# Altium project LSS_Gripper_Top_Board.PrjPcb
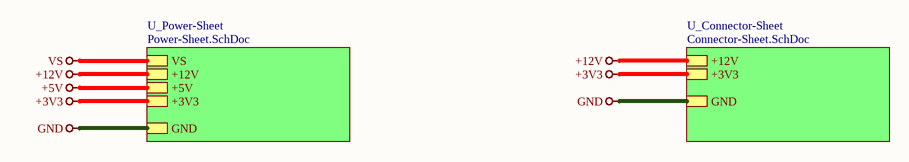
[diagram p0: Top-Sheet.SchDoc]
3 sheets, 36 parts. Net scope: hierarchical (ports join the sheet entries above them; power ports are global).
Board files: PCB1.PcbDoc, GripperTopBoard.PcbDoc
Sheets:
  Top-Sheet.SchDoc
    U_Connector-Sheet = Connector-Sheet.SchDoc
    U_Power-Sheet = Power-Sheet.SchDoc

## Sheet Top-Sheet.SchDoc
size 420 x 297 mm; SheetNumber: 1; SheetTotal: 3

### Sub-sheets
U_Connector-Sheet = Connector-Sheet.SchDoc: +12V, +3V3, GND
U_Power-Sheet = Power-Sheet.SchDoc: +12V, +5V, +3V3, GND, VS

### Nets
+3V3: sheet U_Connector-Sheet/+3V3, sheet U_Power-Sheet/+3V3
+12V: sheet U_Connector-Sheet/+12V, sheet U_Power-Sheet/+12V
GND: sheet U_Connector-Sheet/GND, sheet U_Power-Sheet/GND

### Notes on the sheet
- File:
- Title:
- Date:
- Page
- Num:
- Total:
- Drawn By: Huzaifa Ali

## Sheet Connector-Sheet.SchDoc
size 420 x 297 mm; SheetNumber: 3; SheetTotal: 3
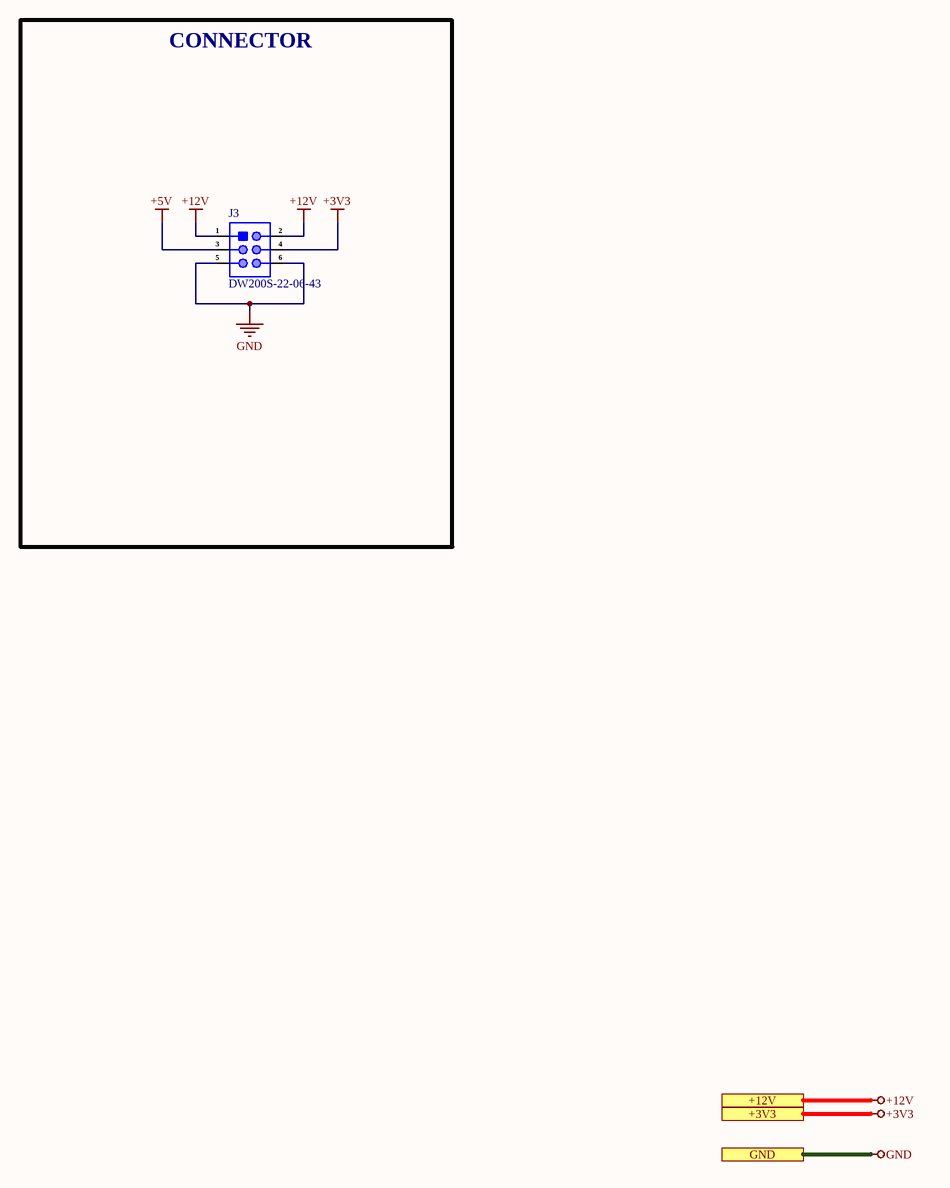
[diagram p1: Connector-Sheet.SchDoc]

### Parts
J3  DW200S-22-06-43  [HDR2X3 (Female SMD)]

### Blocks framed on the sheet
CONNECTOR: J3

### Ports
+3V3 (see Top-Sheet[3A], Power-Sheet[4D]), +12V (see Top-Sheet[3A], Power-Sheet[4D]), GND (see Top-Sheet[3B], Power-Sheet[4D])

### Nets
+3V3: J3.4 ; port +3V3
+5V: J3.3
+12V: J3.1 J3.2 ; port +12V
GND: J3.5 J3.6 ; port GND

### Notes on the sheet
- File:
- Title:
- Date:
- Page
- Num:
- Total:
- Drawn By: Huzaifa Ali

### Library data of the parts
J3 = DW200S-22-06-43: 2mm 双排 6P Brick nogging 2x3P SMD,P=2mm Female Headers ROHS; Manufacturer: DEALON; Manufacturer Part Number: DW200S-22-06-43; Package: SMD,P=2mm; LCSC Part Number: C5160809; Item Type: Female Header; ComponentLink1Description: LCSC; ComponentLink1URL: https://www.lcsc.com/product-detail/span-style-background-color-ff0-Female-span-Headers_DEALON-DW200S-22-06-43_C5160809.html

## Sheet Power-Sheet.SchDoc
size 420 x 297 mm; SheetNumber: 2; SheetTotal: 3
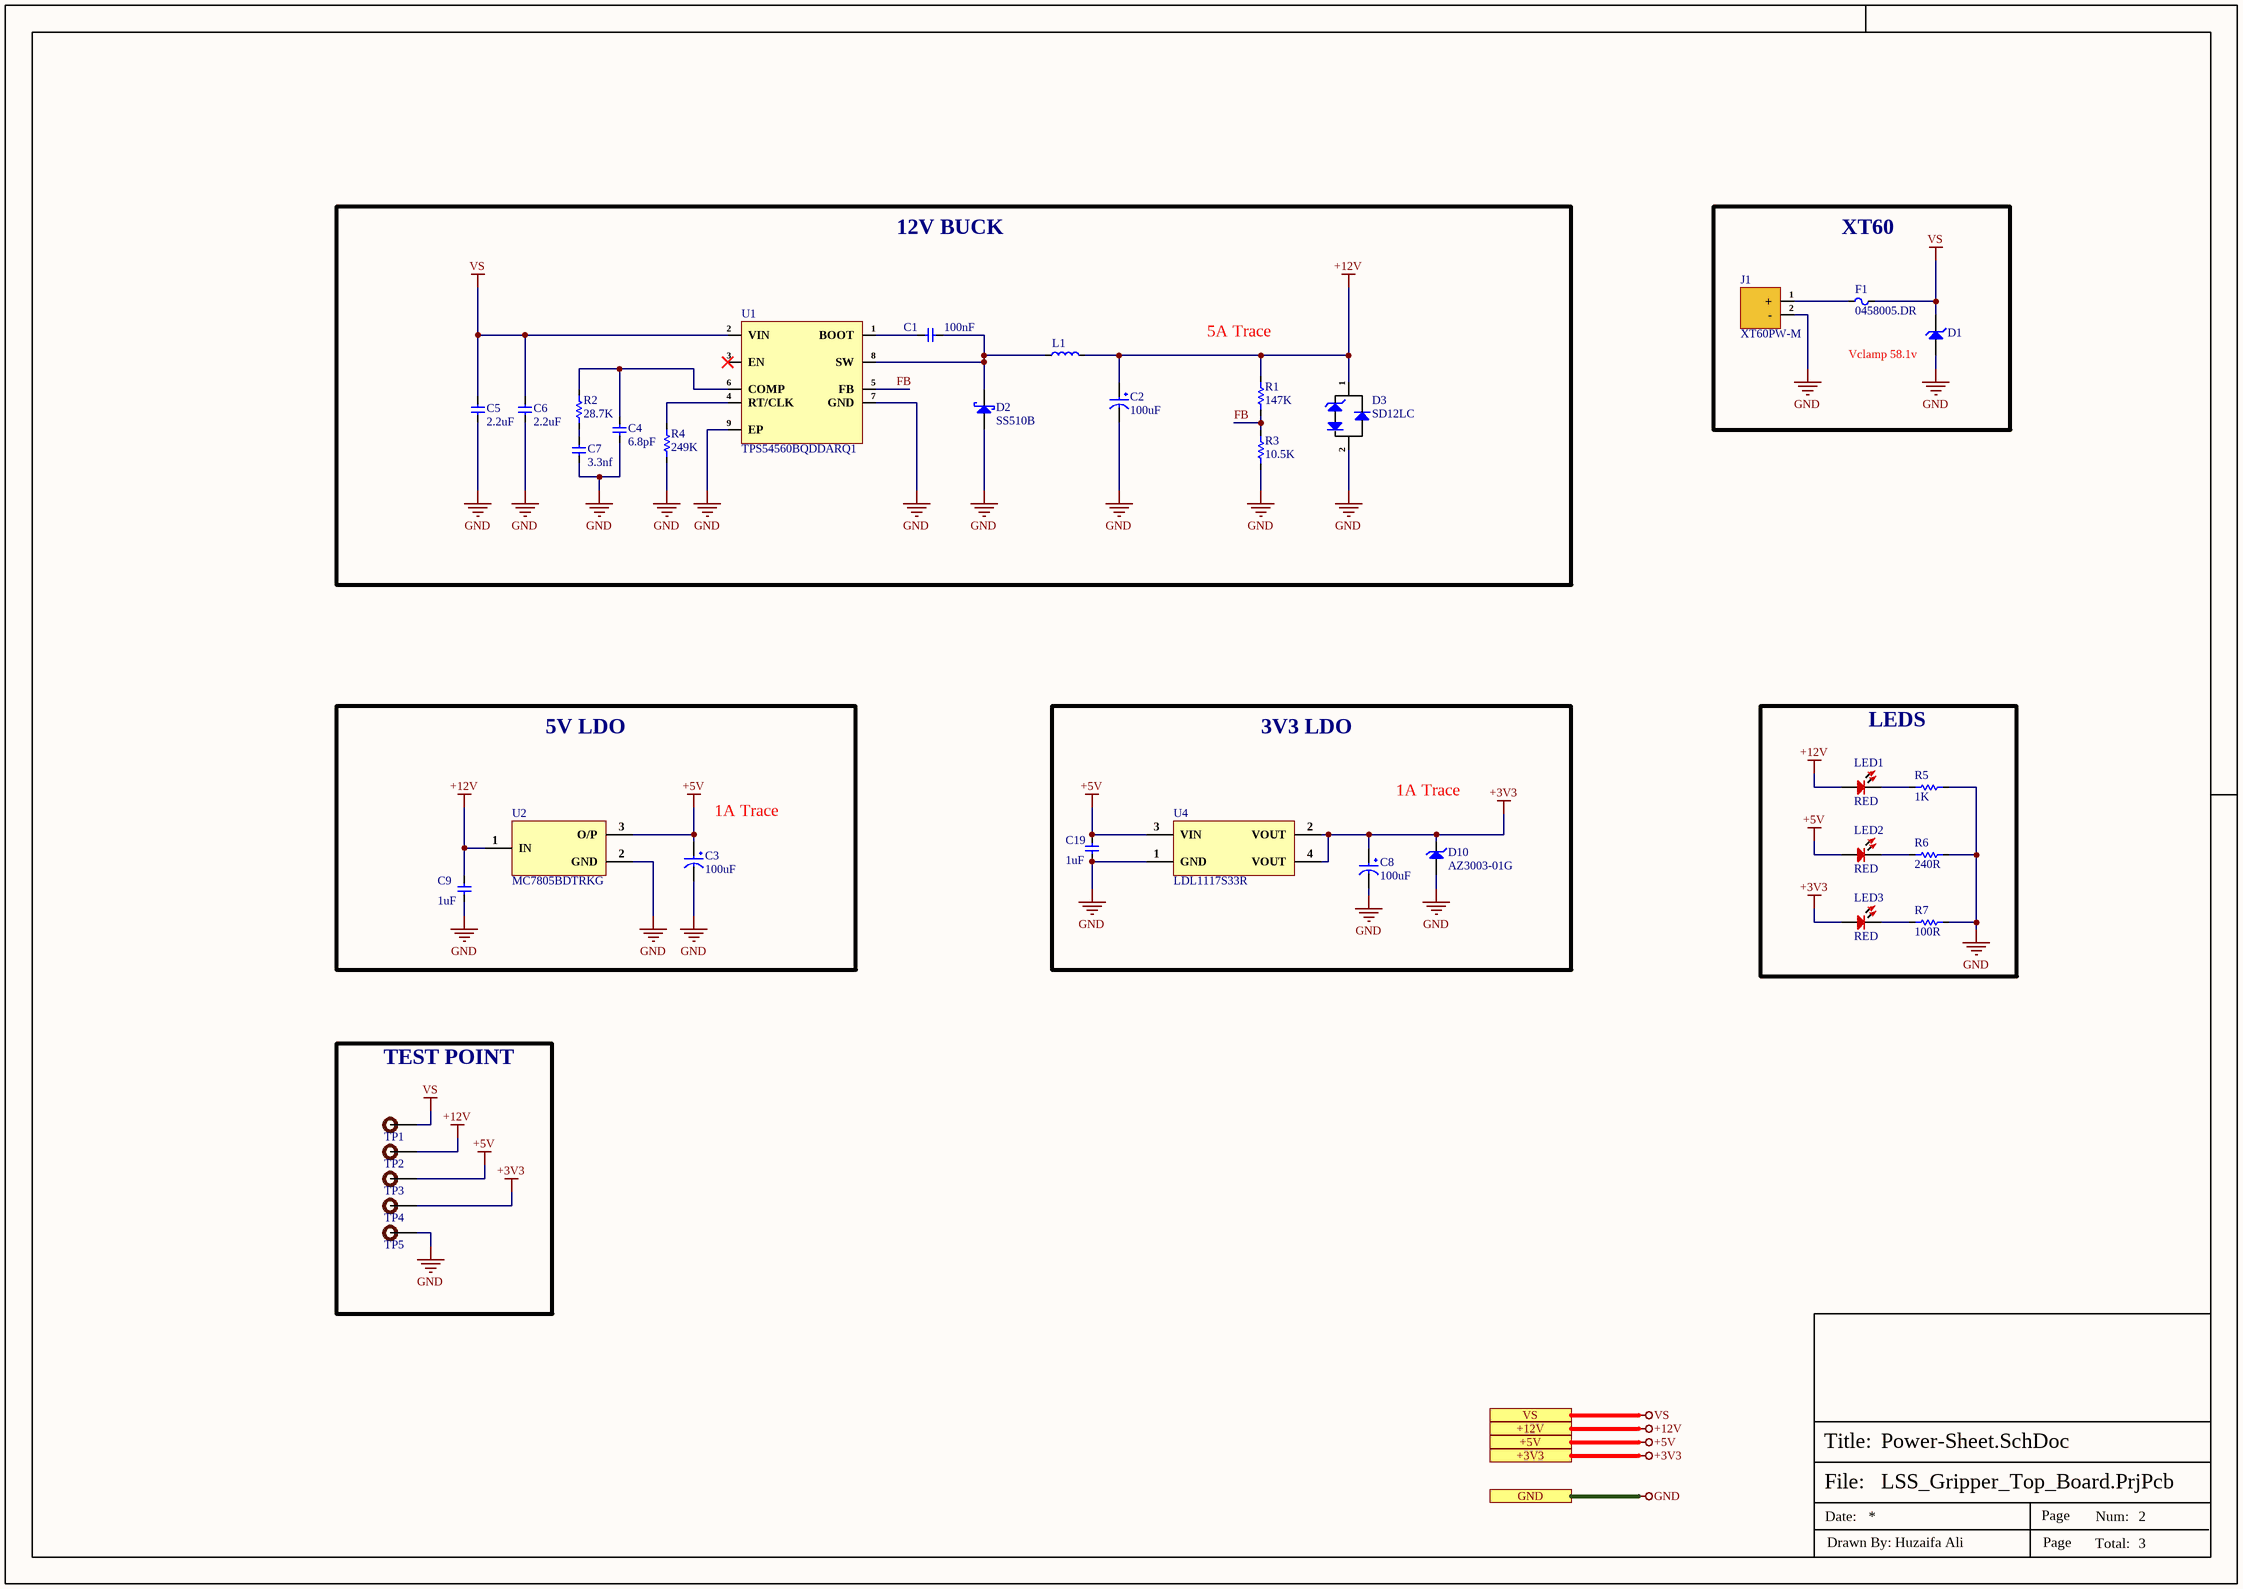
[diagram p2: Power-Sheet.SchDoc]

### Parts
C1  100nF  [cap-0402]
C2  100uF  [Case-E]
C3  100uF  [Case-E]
C4  6.8pF  [Cap-0402]
C5  2.2uF  [Cap-0805]
C6  2.2uF  [Cap-0805]
C7  3.3nf  [Cap-0402]
C8  100uF  [Case-E]
C9  1uF  [Cap-0603]
C19  1uF  [Cap-0603]
D1  AZ4036-01G  [SOD-123]  (value not drawn)
D2  SS510B  [SMB_]
D3  SD12LC  [SOD-323]
D10  AZ3003-01G  [SOD-123]
F1  0458005.DR  [Fuse 1206 (3216 Metric)]
J1  XT60PW-M  [XT60PW-M]
L1  CXP1050-220M-AG(22uh)  [CXP1050-220M-AG(22uh)]  (value not drawn)
LED1  RED  [LED-0603]
LED2  RED  [LED-0603]
LED3  RED  [LED-0603]
R1  147K  [Res-0402]
R2  28.7K  [Res-0402]
R3  10.5K  [Res-0402]
R4  249K  [Res-0402]
R5  1K  [Res-0402]
R6  240R  [Res-0402]
R7  100R  [Res-0402]
TP1  TEST POINT  [Test-point]  (value not drawn)  (no BOM)
TP2  TEST POINT  [Test-point]  (value not drawn)  (no BOM)
TP3  TEST POINT  [Test-point]  (value not drawn)  (no BOM)
TP4  TEST POINT  [Test-point]  (value not drawn)  (no BOM)
TP5  TEST POINT  [Test-point]  (value not drawn)  (no BOM)
U1  TPS54560BQDDARQ1  [8-SO PowerPad]
U2  MC7805BDTRKG  [DPAK_]
U4  LDL1117S33R  [SOT- 223]

### Blocks framed on the sheet
12V BUCK: C1 C2 C4-C7 D2 D3 L1 R1-R4 U1
XT60: D1 F1 J1
5V LDO: C3 C9 U2
3V3 LDO: C8 C19 D10 U4
LEDS: LED1-LED3 R5-R7
TEST POINT: TP1-TP5

### Ports
+3V3 (see Top-Sheet[2B]), +5V (see Top-Sheet[2B]), +12V (see Top-Sheet[2A]), GND (see Top-Sheet[2B]), VS (see Top-Sheet[2A])

### Nets
+3V3: C8.1 D10.2(K) LED3.1 TP4.1 U4.2(VOUT) U4.4(VOUT) ; port +3V3
+5V: C3.1 C19.2 LED2.1 TP3.1 U2.3(O/P) U4.3(VIN) ; port +5V
+12V: C2.1 C9.2 D3.1(K) L1.2 LED1.1 R1.2 TP2.1 U2.1(IN) ; port +12V
GND: C2.2 C3.2 C4.1 C5.1 C6.1 C7.1 C8.2 C9.1 C19.1 D1.1(A) D2.1(A) D3.2(A/K) D10.1(A) J1.2(-) R3.1 R4.1 R5.2 R6.2 R7.2 TP5.1 U1.7(GND) U1.9(EP) U2.2(GND) U4.1(GND) ; port GND
VS: C5.2 C6.2 D1.2(K) F1.2 TP1.1 U1.2(VIN) ; port VS
FB: R1.1 R3.2 U1.5(FB)
NetC1_1: C1.1 D2.2(K) L1.1 U1.8(SW)
NetC1_2: C1.2 U1.1(BOOT)
NetC4_2: C4.2 R2.2 U1.6(COMP)
NetC7_2: C7.2 R2.1
NetF1_1: F1.1 J1.1(+)
NetLED1_2: LED1.2 R5.1
NetLED2_2: LED2.2 R6.1
NetLED3_2: LED3.2 R7.1
NetR4_2: R4.2 U1.4(RT/CLK)

Not connected (* = marked no-connect by the designer): U1 3(EN)*

### Notes on the sheet
- (near R1) 5A Trace
- (near D1) Vclamp 58.1v
- 1A Trace
- (near C3) 1A Trace
- File:
- Title:
- Date:
- Page
- Num:
- Total:
- Drawn By: Huzaifa Ali

### Library data of the parts
C1 = C1005X7R1H104KT000F: CAP CER 0.1UF 50V X7R 0402; Manufacturer: TDK; Tolerance: 10%; Voltage: 25V; Item Type: Capacitor; Supplier 1: Avnet; Manufacturer Part Number: C1005X7R1H104KT000F; RoHS: No; Category: Ceramic Capacitors; Dielectric: X7R; Supplier Part Number 1: C1005X7R1H104KT000F; LCSC Part Number: C361198; ComponentLink1Description: LCSC; ComponentLink1URL: https://www.lcsc.com/product-detail/Multilayer-Ceramic-Capacitors-MLCC-SMD-SMT_TDK-C1005X7R1H104KT000F_C361198.html
C2 C3 C8 = TAJE107M025RNJ: CAP TANT 100UF 20% 25V 2917; Manufacturer: Kyocera AVX; ESR (Equivalent Series Resistance): 300mR; Leakage Current: 25uA; Polarity: Polar; Dissipation Factor: 10%; Supplier 1: Mouser; Manufacturer Part Number: TAJE107M025RNJ; RoHS: Yes; Category: Tantalum Capacitors; Stock 1: 109; Pricing 1: 1=2.81000, 10=2.81000, 50=2.81000, 100=2.19000, 1000=1.76000, 10000=1.76000 (USD); Mount: Surface Mount; Case/Package: 2917; Number of Pins: 2; Case Code (Imperial): 2917; Case Code (Metric): 7343; Min Operating Temperature: -55°C; Max Operating Temperature: 125°C; Capacitance: 100uF; Tolerance: 20%; Packaging: Tape and Reel; Voltage Rating: 25V; Voltage Rating (DC): 25V; Features: General Purpose; Package Quantity: 1; Termination: SMD/SMT; Series: TAJ; Construction: Flat; Length: 7.3mm; Width: 4.3mm; Height: 4.3mm; Depth: 4.3mm; Height - Seated (Max): 0.169inch; Radiation Hardening: No; Lead Free: Lead Free; RoHS Compliant: Yes; REACH SVHC: No SVHC; ComponentLink1URL: https://datasheet.ciiva.com/26787/taje107m025rnj-26787048.pdf?src-supplier=IIIC; ComponentLink1Description: https://datasheet.ciiva.com/26787/taje107m025rnj-26787048.pdf?src-supplier=IIIC; ComponentLink2URL: https://datasheet.ciiva.com/265/taj-265541.pdf?src-supplier=Digi-Key; ComponentLink2Description: https://datasheet.ciiva.com/265/taj-265541.pdf?src-supplier=Digi-Key; ComponentLink3URL: https://datasheet.ciiva.com/265/taj-265542.pdf?src-supplier=Digi-Key; ComponentLink3Description: https://datasheet.ciiva.com/265/taj-265542.pdf?src-supplier=Digi-Key; ComponentLink4URL: https://datasheet.ciiva.com/265/taj-265540.pdf?src-supplier=Digi-Key; ComponentLink4Description: https://datasheet.ciiva.com/265/taj-265540.pdf?src-supplier=Digi-Key; ComponentLink5URL: https://datasheet.ciiva.com/28609/1719052-28609254.pdf?src-supplier=Element14; ComponentLink5Description: https://datasheet.ciiva.com/28609/1719052-28609254.pdf?src-supplier=Element14; ComponentLink6URL: https://datasheet.ciiva.com/11230/taj-11230456.pdf?src-supplier=Avnet; ComponentLink6Description: https://datasheet.ciiva.com/11230/taj-11230456.pdf?src-supplier=Avnet; ComponentLink7URL: https://datasheet.ciiva.com/17339/taj-17339677.pdf?src-supplier=Avnet+Europe; ComponentLink7Description: https://datasheet.ciiva.com/17339/taj-17339677.pdf?src-supplier=Avnet+Europe; ComponentLink8URL: https://datasheet.ciiva.com/22667/1719052-22667581.pdf?src-supplier=Element14; ComponentLink8Description: https://datasheet.ciiva.com/22667/1719052-22667581.pdf?src-supplier=Element14; Supplier Part Number 1: 581-TAJE107M025RNJ; LCSC Part Number: C7230
C4 = CC0402CRNPO9BN6R8: CAP CER 6.8PF 50V C0G/NPO 0402; Manufacturer: Yageo; Dielectric: C0G; Tolerance: 2%; Insulation Resistance: 10GR; Item Type: Capacitor; Supplier: Future Electronics; Supplier Part Number: 3247368; Manufacturer Part Number: CC0402CRNPO9BN6R8; RoHS: Yes; Category: Ceramic Capacitors; Stock: 200000; Pricing: 10000=0.0024, 40000=0.0022, 150000=0.0021, 400000=0.002, 1000000=0.0019 (USD); Mounting Technology: Surface Mount; Case/Package: 0402; Case Code (Imperial): 0402; Case Code (Metric): 1005; Weight: 2.3E-05oz; Min Operating Temperature: -55°C; Max Operating Temperature: 125°C; Value: 6.8pF; Packaging: Tape and Reel; Voltage Rating: 50V; Voltage Rating (DC): 50V; Termination: SMD/SMT; Series: CC; Construction: Flat; Length: 1mm; Width: 0.5mm; Height: 0.5mm; Depth: 0.5mm; Radiation Hardening: No; RoHS Compliant: Yes; ComponentLink1URL: https://datasheet.ciiva.com/11587/upy-gp-np0-16v-to-50v-8-11587182.pdf?src-supplier=Avnet; ComponentLink1Description: https://datasheet.ciiva.com/11587/upy-gp-np0-16v-to-50v-8-11587182.pdf?src-supplier=Avnet; LCSC Part Number: C189470
C5 C6 = GRM21BD72A225KE01L: CAP CER 2.2UF 100V X7T 0805; Manufacturer: Murata; Item Type: Capacitor; Supplier 1: Digi-Key; Manufacturer Part Number: GRM21BD72A225KE01L; RoHS: No; Category: Ceramic Capacitors; Stock 1: 2439; Pricing 1: 1=0.55000, 10=0.38600, 50=0.29220, 100=0.25440, 500=0.18846, 1000=0.16020 (USD); RoHS Compliant: Yes; LCSC Part Number: C2981733; ComponentLink1Description: LCSC; ComponentLink1URL: https://www.lcsc.com/product-detail/Multilayer-Ceramic-Capacitors-MLCC-SMD-SMT_Murata-Electronics-GRM21BD72A225KE01L_C2981733.html; Supplier Part Number 1: 490-GRM21BD72A225KE01LCT-ND
C7 = CC0402KRX7R9BB332: CAP CER 3.3nF 50V X7R 0402; Manufacturer: Yageo; Dielectric Material: Ceramic; Tolerance: 10%; Insulation Resistance: 100GR; Item Type: Capacitor; Supplier 1: Future Electronics; Manufacturer Part Number: CC0402KRX7R9BB332; RoHS: Yes; Category: Ceramic Capacitors; Stock 1: 1190000; Pricing 1: 10000=0.00230, 40000=0.00200, 50000=0.00220, 150000=0.00190, 250000=0.00200, 400000=0.00180, 1000000=0.00190, 2500000=0.00180 (USD); Mount: Surface Mount; Case/Package: 0402; Number of Pins: 2; Case Code (Metric): 1005; Case Code (Imperial): 0402; Min Operating Temperature: -55°C; Max Operating Temperature: 125°C; Capacitance: 3.3nF; Dielectric: X7R; Packaging: Tape and Reel; Voltage Rating: 50V; Voltage Rating (DC): 50V; Package Quantity: 1; Termination: SMD/SMT; Voltage: 50V; Series: CC; Length: 1mm; Width: 0.02inch; Height: 0.5mm; Thickness: 0.022inch; Depth: 0.5mm; Terminal Length: 0.225mm; Radiation Hardening: No; Reach SVHC Compliant: Yes; Lead Free: Lead Free; Halogen Free: Halogen Free; RoHS Compliant: Yes; ComponentLink1URL: https://datasheet.ciiva.com/144/mlccorderingcode-144014.pdf?src-supplier=Digi-Key; ComponentLink1Description: https://datasheet.ciiva.com/144/mlccorderingcode-144014.pdf?src-supplier=Digi-Key; ComponentLink2URL: https://datasheet.ciiva.com/144/mlccorderingcode-144013.pdf?src-supplier=Digi-Key; ComponentLink2Description: https://datasheet.ciiva.com/144/mlccorderingcode-144013.pdf?src-supplier=Digi-Key; ComponentLink3URL: https://datasheet.ciiva.com/144/mlccorderingcode-144015.pdf?src-supplier=Digi-Key; ComponentLink3Description: https://datasheet.ciiva.com/144/mlccorderingcode-144015.pdf?src-supplier=Digi-Key; ComponentLink4URL: https://datasheet.ciiva.com/11786/0900766b80d84f1d-11786153.pdf?src-supplier=Rs; ComponentLink4Description: https://datasheet.ciiva.com/11786/0900766b80d84f1d-11786153.pdf?src-supplier=Rs; ComponentLink5URL: https://datasheet.ciiva.com/7978/1489800-7978103.pdf?src-supplier=Element14; ComponentLink5Description: https://datasheet.ciiva.com/7978/1489800-7978103.pdf?src-supplier=Element14; ComponentLink6URL: https://datasheet.ciiva.com/28450/1489800-28450409.pdf?src-supplier=Element14; ComponentLink6Description: https://datasheet.ciiva.com/28450/1489800-28450409.pdf?src-supplier=Element14; ComponentLink7URL: https://datasheet.ciiva.com/5789/1489800-5789558.pdf?src-supplier=Farnell; ComponentLink7Description: https://datasheet.ciiva.com/5789/1489800-5789558.pdf?src-supplier=Farnell; ComponentLink8URL: https://datasheet.ciiva.com/8033/1489800-8033630.pdf?src-supplier=Element14; ComponentLink8Description: https://datasheet.ciiva.com/8033/1489800-8033630.pdf?src-supplier=Element14; ComponentLink9URL: https://datasheet.ciiva.com/22745/1489800-22745767.pdf?src-supplier=Element14; ComponentLink9Description: https://datasheet.ciiva.com/22745/1489800-22745767.pdf?src-supplier=Element14; ComponentLink10URL: https://datasheet.ciiva.com/5425/upy-gphc-x7r-6-3v-to-50v-8-12304-5425518.pdf?src-supplier=Mouser; ComponentLink10Description: https://datasheet.ciiva.com/5425/upy-gphc-x7r-6-3v-to-50v-8-12304-5425518.pdf?src-supplier=Mouser; ComponentLink11URL: https://datasheet.ciiva.com/11586/upy-gphc-x7r-6-3v-to-50v-8-11586486.pdf?src-supplier=Avnet; ComponentLink11Description: https://datasheet.ciiva.com/11586/upy-gphc-x7r-6-3v-to-50v-8-11586486.pdf?src-supplier=Avnet; ComponentLink12URL: https://datasheet.ciiva.com/15189/getdatasheetpartid-315557-15189133.pdf?src-supplier=Verical; ComponentLink12Description: https://datasheet.ciiva.com/15189/getdatasheetpartid-315557-15189133.pdf?src-supplier=Verical; Supplier Part Number 1: 9776550; LCSC Part Number: C107028
C9 C19 = CC0603KRX5R8BB105: CAP CER 1UF 25V X5R 0603; Manufacturer: Yageo; Tolerance: 10%; Item Type: Capacitor; Supplier 1: Digi-Key; Manufacturer Part Number: CC0603KRX5R8BB105; RoHS: Yes; Category: Ceramic Capacitors; Stock 1: 919939; Pricing 1: 1=0.12000, 10=0.08400, 50=0.04760, 100=0.03940, 500=0.02764, 1000=0.02288 (USD); Mount: Surface Mount; Case/Package: 0603; Number of Pins: 2; Case Code (Metric): 1608; Case Code (Imperial): 0603; Min Operating Temperature: -55°C; Max Operating Temperature: 85°C; Capacitance: 1uF; Dielectric: X5R; Package Quantity: 1; Voltage Rating: 25V; Packaging: Tape and Reel; Termination: SMD/SMT; Voltage Rating (DC): 25V; Series: CC; Construction: Flat; Length: 1.6mm; Width: 0.031inch; Height: 0.8mm; Thickness: 0.035inch; Depth: 0.8mm; Radiation Hardening: No; REACH SVHC: No SVHC; Lead Free: Lead Free; Halogen Free: Halogen Free; RoHS Compliant: Yes; ComponentLink1URL: https://datasheet.ciiva.com/176/mlccorderingcode-176785.pdf?src-supplier=Digi-Key; ComponentLink1Description: https://datasheet.ciiva.com/176/mlccorderingcode-176785.pdf?src-supplier=Digi-Key; ComponentLink2URL: https://datasheet.ciiva.com/176/mlccorderingcode-176786.pdf?src-supplier=Digi-Key; ComponentLink2Description: https://datasheet.ciiva.com/176/mlccorderingcode-176786.pdf?src-supplier=Digi-Key; ComponentLink3URL: https://datasheet.ciiva.com/176/mlccorderingcode-176787.pdf?src-supplier=Digi-Key; ComponentLink3Description: https://datasheet.ciiva.com/176/mlccorderingcode-176787.pdf?src-supplier=Digi-Key; ComponentLink4URL: https://datasheet.ciiva.com/17436/upy-gphc-x5r-4v-to-50v-12-17436952.pdf?src-supplier=Avnet+Europe; ComponentLink4Description: https://datasheet.ciiva.com/17436/upy-gphc-x5r-4v-to-50v-12-17436952.pdf?src-supplier=Avnet+Europe; ComponentLink5URL: https://datasheet.ciiva.com/7978/1525783-7978171.pdf?src-supplier=Element14; ComponentLink5Description: https://datasheet.ciiva.com/7978/1525783-7978171.pdf?src-supplier=Element14; ComponentLink6URL: https://datasheet.ciiva.com/11586/upy-gphc-x5r-4v-to-50v-12-11586318.pdf?src-supplier=Avnet; ComponentLink6Description: https://datasheet.ciiva.com/11586/upy-gphc-x5r-4v-to-50v-12-11586318.pdf?src-supplier=Avnet; Supplier Part Number 1: 311-1445-1-ND; LCSC Part Number: C14664
D1 = AZ4036-01G: Clamp Ipp Tvs Diode Surface Mount SOD-123; Manufacturer: Amazing; Manufacturer Part Number: AZ4036-01G; Package: SOD-123; LCSC Part Number: -; Item Type: Diode; ComponentLink1Description: Digikey; ComponentLink1URL: https://www.digikey.com/en/products/detail/amazing/AZ4036-01G/16615419
D2 = SS510B: SCHOTTKY DIODE SMB 100V 5A; Manufacturer: MDD; Manufacturer Part Number: SS510B; Package: SMB; ComponentLink1Description: LCSC; ComponentLink1URL: https://www.lcsc.com/product-detail/Schottky-Barrier-Diodes-SBD_JUXING-SS510B_C3011128.html; LCSC Part Number: C3011128; Item Type: Diode
D3 = SD12LC: TVS DIODE 12VWM 28.6VC SOD323; Manufacturer: Sangdest Microelectronics; Supplier: DigiKey; Supplier Part Number: 1655-SD12LCCT-ND; Manufacturer Part Number: SD12LC; Stock: 575; Pricing: 1=0.43, 10=0.305, 100=0.1541, 500=0.13654, 1000=0.10625 (USD); Item Type: Diode
D10 = AZ3003-01G: TVS SURGE PROTECTOR 1-CH 3.3V; Manufacturer: Amazing; Item Type: Diode; Manufacturer Part Number: AZ3003-01G; Package: SOD-123; LCSC Part Number: -; ComponentLink1Description: Digikey; ComponentLink1URL: https://www.digikey.com/en/products/detail/amazing/AZ3003-01G/16615352?s=N4IgTCBcDaIIIC0DMAGFSC0KCMBxEAugL5A
F1 = 0458005.DR: FUSE BRD MNT 5A 32VAC 75VDC 1206; Manufacturer: Littelfuse; Supplier: Rs; Supplier Part Number: 1740294; Manufacturer Part Number: 0458005.DR; RoHS: Yes; Category: Fuses; Stock: 1005; Pricing: 1=0.6241, 10=0.73892, 25=0.71895, 50=0.70003 (GBP); ComponentLink1URL: https://datasheet.ciiva.com/1730/337915-1730547.pdf?src-supplier=Newark; ComponentLink1Description: https://datasheet.ciiva.com/1730/337915-1730547.pdf?src-supplier=Newark; ComponentLink2URL: https://datasheet.ciiva.com/7991/337915-7991910.pdf?src-supplier=Element14; ComponentLink2Description: https://datasheet.ciiva.com/7991/337915-7991910.pdf?src-supplier=Element14; ComponentLink3URL: https://datasheet.ciiva.com/299/littelfuse-fuse-458-series-299786.pdf?src-supplier=Digikey; ComponentLink3Description: https://datasheet.ciiva.com/299/littelfuse-fuse-458-series-299786.pdf?src-supplier=Digikey; ComponentLink4URL: https://datasheet.ciiva.com/299/littelfuse-fuse-458-series-299787.pdf?src-supplier=Digikey; ComponentLink4Description: https://datasheet.ciiva.com/299/littelfuse-fuse-458-series-299787.pdf?src-supplier=Digikey; ComponentLink5URL: https://datasheet.ciiva.com/299/littelfuse-fuse-458-series-299788.pdf?src-supplier=Digikey; ComponentLink5Description: https://datasheet.ciiva.com/299/littelfuse-fuse-458-series-299788.pdf?src-supplier=Digikey; LCSC Part Number: C187561; Item Type: Fuse
J1 = XT60PW-M: Power Connectors ROHS; Manufacturer: Changzhou Amass Elec; Manufacturer Part Number: XT60PW-M; Package: Custom; LCSC Part Number: C98732; Item Type: Connector; ComponentLink1Description: LCSC; ComponentLink1URL: https://jlcpcb.com/partdetail/Changzhou_AmassElec-XT60PWM/C98732
L1 = CXP1050-220M-AG(22uh): 5.5A 22uH Molding Choke ±20% 8A 1050 Power Inductors ROHS; Manufacturer: DMBJ; Manufacturer Part Number: CXP1050-220M-AG(22uh); Package: 1050; LCSC Part Number: C7461393; Item Type: Inductor; ComponentLink1Description: LCSC; ComponentLink1URL: https://www.lcsc.com/product-detail/Power-Inductors_DMBJ-CXP1050-220M-AG-22uh_C7461393.html
LED1-LED3 = NCD0603R3: RED LED 0603 Light Emitting Diodes; Manufacturer: Foshan NationStar Optoelectronics; Manufacturer Part Number: NCD0603R3; Package: 0603; Item Type: LED; LCSC Part Number: C3151730; ComponentLink1Description: LCSC; ComponentLink1URL: https://www.lcsc.com/product-detail/Light-Emitting-Diodes-LED_Foshan-NationStar-Optoelectronics-NCD0603R3_C3151730.html
R1 = RC0402FR-07147KL: RES 147K OHM 1% 1/16W 0402; Manufacturer: Yageo; Item Type: Resistors; Voltage Rating: 50V; Value: 147kR; Power Rating: 62.5mW; Max Power Dissipation: 63mW; Temperature Coefficient: 100ppm/°C; Supplier: Future Electronics; Supplier Part Number: 1233261; Manufacturer Part Number: RC0402FR-07147KL; RoHS: Yes; Stock: 30000; Pricing: 10000=0.0012, 100000=0.0011, 300000=0.001, 750000=0.001, 2000000=0.0009 (USD); Case/Package: 0402; Case Code (Imperial): 0402; Case Code (Metric): 1005; Min Operating Temperature: -55°C; Max Operating Temperature: 155°C; Packaging: Tape and Reel; Termination: SMD/SMT; Tolerance: 1%; Number of Terminations: 2; Features: Moisture Resistant; Series: RC; Construction: Rectangular; Voltage Rating (DC): 50V; Length: 1mm; Width: 0.5mm; Height: 0.016inch; Depth: 0.5mm; Military Standard: Not; RoHS Compliant: Yes; Lead Free: 5697LeadFree; LCSC Part Number: C163489
R2 = NQ02WGF2872TCE: 62.5mW 100V ±1% 28.7kΩ 0402 Chip Resistor - Surface Mount ROHS; Manufacturer: Royal Ohm; Supplier: Mouser; Supplier Part Number: 303-NQ02WGF2872TCE; Manufacturer Part Number: NQ02WGF2872TCE; Pricing: 10000=0.002 (USD); LCSC Part Number: C2779810; Item Type: Resistor
R3 = CRCW040210K5FKED: RES SMD 10.5K OHM 1% 1/16W 0402; Manufacturer: Vishay; Item Type: Resistors; Voltage Rating (DC): 50V; Supplier: Mouser; Supplier Part Number: 71-CRCW0402-10.5K-E3; Manufacturer Part Number: CRCW040210K5FKED; RoHS: Yes; Stock: 26970; Pricing: 1=0.1, 10=0.017, 50=0.017, 100=0.01, 1000=0.007, 10000=0.004 (USD); Lead Free: 5697LeadFree; ComponentLink1URL: https://datasheet.ciiva.com/11817/0900766b80d98824-11817996.pdf?src-supplier=Rs; ComponentLink1Description: https://datasheet.ciiva.com/11817/0900766b80d98824-11817996.pdf?src-supplier=Rs; ComponentLink2URL: https://datasheet.ciiva.com/3255/dcrcwe3-3255967.pdf?src-supplier=Avnet; ComponentLink2Description: https://datasheet.ciiva.com/3255/dcrcwe3-3255967.pdf?src-supplier=Avnet; ComponentLink3URL: https://datasheet.ciiva.com/22700/1697337-22700669.pdf?src-supplier=Element14; ComponentLink3Description: https://datasheet.ciiva.com/22700/1697337-22700669.pdf?src-supplier=Element14; ComponentLink4URL: https://datasheet.ciiva.com/2463/dcrcwe3-2463739.pdf?src-supplier=Digikey; ComponentLink4Description: https://datasheet.ciiva.com/2463/dcrcwe3-2463739.pdf?src-supplier=Digikey; ComponentLink5URL: https://datasheet.ciiva.com/2463/dcrcwe3-2463740.pdf?src-supplier=Digikey; ComponentLink5Description: https://datasheet.ciiva.com/2463/dcrcwe3-2463740.pdf?src-supplier=Digikey; ComponentLink6URL: https://datasheet.ciiva.com/2463/dcrcwe3-2463741.pdf?src-supplier=Digikey; ComponentLink6Description: https://datasheet.ciiva.com/2463/dcrcwe3-2463741.pdf?src-supplier=Digikey; ComponentLink7URL: https://datasheet.ciiva.com/7743/125364-7743419.pdf?src-supplier=Element14; ComponentLink7Description: https://datasheet.ciiva.com/7743/125364-7743419.pdf?src-supplier=Element14; ComponentLink8URL: https://datasheet.ciiva.com/7663/1697337-7663816.pdf?src-supplier=Element14; ComponentLink8Description: https://datasheet.ciiva.com/7663/1697337-7663816.pdf?src-supplier=Element14; ComponentLink9URL: https://datasheet.ciiva.com/7663/1697337-7663817.pdf?src-supplier=Element14; ComponentLink9Description: https://datasheet.ciiva.com/7663/1697337-7663817.pdf?src-supplier=Element14; ComponentLink10URL: https://datasheet.ciiva.com/16394/dcrcwe3-16394264.pdf?src-supplier=Future+Electronics; ComponentLink10Description: https://datasheet.ciiva.com/16394/dcrcwe3-16394264.pdf?src-supplier=Future+Electronics; ComponentLink11URL: https://datasheet.ciiva.com/16777/70201119-16777227.pdf?src-supplier=Allied+Electronics; ComponentLink11Description: https://datasheet.ciiva.com/16777/70201119-16777227.pdf?src-supplier=Allied+Electronics; LCSC Part Number: C481924
R4 = 0402WGF2493TCE: 62.5mW Thick Film Resistors 50V ±100ppm/℃ ±1% 249kΩ 0402 Chip Resistor - Surface Mount ROHS; Manufacturer: Royal Electronic Factory; Supplier: Mouser; Supplier Part Number: 303-0402WGF2493TCE; Manufacturer Part Number: 0402WGF2493TCE; RoHS: No; Pricing: 10000=0.004 (USD); LCSC Part Number: C11425; Item Type: Resistor
R5 = RC0402FR-071KL: RES 1K OHM 1% 1/16W 0402; Manufacturer: Yageo; Resistance: 1kR; Temperature Coefficient: 100ppm/°C; Voltage Rating (DC): 50V; Power Rating: 62.5mW; Max Power Dissipation: 63mW; Item Type: Resistor; Supplier 1: Avnet; Manufacturer Part Number: RC0402FR-071KL; RoHS: Yes; Category: Chip SMD Resistors; Stock 1: 13030000; Pricing 1: 10000=0.00085, 20000=0.00087, 40000=0.00084, 60000=0.00083, 80000=0.00079, 100000=0.00078, 1000000=0.00076 (USD); Case/Package: 0402; Number of Pins: 2; Case Code (Imperial): 0402; Case Code (Metric): 1005; Size Code: 0402; Min Operating Temperature: -55°C; Max Operating Temperature: 155°C; Resistor Type: Thick Film; Tolerance: 1%; Packaging: Tape and Reel; Voltage Rating: 50V; Termination: SMD/SMT; Features: Moisture Resistant; Series: RC; Number of Terminations: 2; Resistance Tolerance: 1%; Construction: Rectangular; Technology: THICK FILM; Length: 1mm; Width: 0.5mm; Height: 0.32mm; Depth: 0.5mm; Reach SVHC Compliant: Yes; Lead Free: Lead Free; RoHS Compliant: Yes; Military Standard: Not; ComponentLink1URL: https://datasheet.ciiva.com/11819/0900766b80c66297-11819477.pdf?src-supplier=RSComponents; ComponentLink1Description: https://datasheet.ciiva.com/11819/0900766b80c66297-11819477.pdf?src-supplier=RSComponents; ComponentLink2URL: https://datasheet.ciiva.com/7983/1018594-7983502.pdf?src-supplier=Element14; ComponentLink2Description: https://datasheet.ciiva.com/7983/1018594-7983502.pdf?src-supplier=Element14; ComponentLink3URL: https://datasheet.ciiva.com/22747/1018594-22747513.pdf?src-supplier=Element14; ComponentLink3Description: https://datasheet.ciiva.com/22747/1018594-22747513.pdf?src-supplier=Element14; ComponentLink4URL: https://datasheet.ciiva.com/12666/pyu-rc0402-51-rohs-l-6-r-12666741.pdf?src-supplier=Mouser; ComponentLink4Description: https://datasheet.ciiva.com/12666/pyu-rc0402-51-rohs-l-6-r-12666741.pdf?src-supplier=Mouser; ComponentLink5URL: https://datasheet.ciiva.com/7849/1018594-7849869.pdf?src-supplier=Element14; ComponentLink5Description: https://datasheet.ciiva.com/7849/1018594-7849869.pdf?src-supplier=Element14; ComponentLink6URL: https://datasheet.ciiva.com/7849/1018594-7849871.pdf?src-supplier=Element14; ComponentLink6Description: https://datasheet.ciiva.com/7849/1018594-7849871.pdf?src-supplier=Element14; ComponentLink7URL: https://datasheet.ciiva.com/17063/pyu-rc0402-51-rohs-l-6-r-17063193.pdf?src-supplier=Future+Electronics; ComponentLink7Description: https://datasheet.ciiva.com/17063/pyu-rc0402-51-rohs-l-6-r-17063193.pdf?src-supplier=Future+Electronics; Supplier Part Number 1: RC0402FR-071KL; LCSC Part Number: C106235
R6 = RC0402FR-07240RL: RES 240 OHM 1% 1/16W 0402; Manufacturer: Yageo; Power Rating: 63mW; Temperature Coefficient: 100ppm/°C; Voltage Rating (DC): 50V; Supplier 1: Mouser; Manufacturer Part Number: RC0402FR-07240RL; RoHS: Yes; Category: Chip SMD Resistors; Stock 1: 1903202; Pricing 1: 1=0.10000, 10=0.01200, 50=0.01200, 100=0.00500, 1000=0.00300, 10000=0.00100 (USD); Case/Package: 0402; Case Code (Metric): 1005; Case Code (Imperial): 0402; Size Code: 0402; Min Operating Temperature: -55°C; Max Operating Temperature: 155°C; Resistance: 240R; Tolerance: 1%; Packaging: Tape and Reel; Resistor Type: Thick Film; Voltage Rating: 50V; Package Quantity: 1; Number of Terminations: 2; Termination: SMD/SMT; Max Power Dissipation: 63mW; Features: Moisture Resistant; Series: RC; Construction: Rectangular; Resistance Tolerance: 1%; Length: 1mm; Width: 0.02inch; Height: 0.016inch; Depth: 0.5mm; REACH SVHC: Unknown; Lead Free: Lead Free; RoHS Compliant: Yes; Military Standard: Not; ComponentLink1URL: https://datasheet.ciiva.com/7849/1018594-7849915.pdf?src-supplier=Element14; ComponentLink1Description: https://datasheet.ciiva.com/7849/1018594-7849915.pdf?src-supplier=Element14; ComponentLink2URL: https://datasheet.ciiva.com/7849/1018594-7849916.pdf?src-supplier=Element14; ComponentLink2Description: https://datasheet.ciiva.com/7849/1018594-7849916.pdf?src-supplier=Element14; ComponentLink3URL: https://datasheet.ciiva.com/2519/pyu-r-int-thick-7-2519157.pdf?src-supplier=Digi-Key; ComponentLink3Description: https://datasheet.ciiva.com/2519/pyu-r-int-thick-7-2519157.pdf?src-supplier=Digi-Key; ComponentLink4URL: https://datasheet.ciiva.com/2519/pyu-r-int-thick-7-2519158.pdf?src-supplier=Digi-Key; ComponentLink4Description: https://datasheet.ciiva.com/2519/pyu-r-int-thick-7-2519158.pdf?src-supplier=Digi-Key; ComponentLink5URL: https://datasheet.ciiva.com/2519/pyu-r-int-thick-7-2519156.pdf?src-supplier=Digi-Key; ComponentLink5Description: https://datasheet.ciiva.com/2519/pyu-r-int-thick-7-2519156.pdf?src-supplier=Digi-Key; ComponentLink6URL: https://datasheet.ciiva.com/12669/pyu-rc0402-51-rohs-l-6-r-12669689.pdf?src-supplier=Mouser; ComponentLink6Description: https://datasheet.ciiva.com/12669/pyu-rc0402-51-rohs-l-6-r-12669689.pdf?src-supplier=Mouser; ComponentLink7URL: https://datasheet.ciiva.com/17419/pyu-rc0402-51-rohs-l-6-r-17419482.pdf?src-supplier=Future+Electronics; ComponentLink7Description: https://datasheet.ciiva.com/17419/pyu-rc0402-51-rohs-l-6-r-17419482.pdf?src-supplier=Future+Electronics; Supplier Part Number 1: 603-RC0402FR-07240RL
R7 = RC0402FR-07100RL: RES 100 OHM 1% 1/16W 0402; Manufacturer: Yageo; Power Rating: 62.5mW; Voltage Rating: 50V; Temperature Coefficient: 100ppm/°C; Max Power Dissipation: 63mW; Item Type: Resistor; Supplier 1: Mouser; Manufacturer Part Number: RC0402FR-07100RL; RoHS: Yes; Category: Chip SMD Resistors; Stock 1: 699545; Pricing 1: 1=0.10000, 10=0.01200, 50=0.01200, 100=0.00500, 1000=0.00300, 2500=0.00200, 10000=0.00100 (USD); Case/Package: 0402; Number of Pins: 2; Case Code (Imperial): 0402; Case Code (Metric): 1005; Size Code: 0402; Min Operating Temperature: -55°C; Max Operating Temperature: 155°C; Tolerance: 1%; Voltage Rating (DC): 50V; Resistance: 100R; Packaging: Tape and Reel; Termination: SMD/SMT; Resistor Type: Thick Film; Features: Moisture Resistant; Series: RC; Number of Terminations: 2; Resistance Tolerance: 1%; Construction: Rectangular; Technology: THICK FILM; Length: 1mm; Width: 0.5mm; Height: 0.32mm; Depth: 0.5mm; RoHS Compliant: Yes; REACH SVHC: No SVHC; Military Standard: Not; Lead Free: Lead Free; ComponentLink1URL: https://datasheet.ciiva.com/11808/0900766b80c66297-11808765.pdf?src-supplier=RSComponents; ComponentLink1Description: https://datasheet.ciiva.com/11808/0900766b80c66297-11808765.pdf?src-supplier=RSComponents; ComponentLink2URL: https://datasheet.ciiva.com/7849/1784430-7849810.pdf?src-supplier=Element14; ComponentLink2Description: https://datasheet.ciiva.com/7849/1784430-7849810.pdf?src-supplier=Element14; ComponentLink3URL: https://datasheet.ciiva.com/28367/1018594-28367226.pdf?src-supplier=Element14; ComponentLink3Description: https://datasheet.ciiva.com/28367/1018594-28367226.pdf?src-supplier=Element14; ComponentLink4URL: https://datasheet.ciiva.com/22747/1018594-22747511.pdf?src-supplier=Element14; ComponentLink4Description: https://datasheet.ciiva.com/22747/1018594-22747511.pdf?src-supplier=Element14; ComponentLink5URL: https://datasheet.ciiva.com/12667/pyu-rc0402-51-rohs-l-6-r-12667957.pdf?src-supplier=Mouser; ComponentLink5Description: https://datasheet.ciiva.com/12667/pyu-rc0402-51-rohs-l-6-r-12667957.pdf?src-supplier=Mouser; ComponentLink6URL: https://datasheet.ciiva.com/15189/getdatasheetpartid-329466-15189335.pdf?src-supplier=Verical; ComponentLink6Description: https://datasheet.ciiva.com/15189/getdatasheetpartid-329466-15189335.pdf?src-supplier=Verical; ComponentLink7URL: https://datasheet.ciiva.com/16740/pyu-rc0402-51-rohs-l-6-r-16740566.pdf?src-supplier=Future+Electronics; ComponentLink7Description: https://datasheet.ciiva.com/16740/pyu-rc0402-51-rohs-l-6-r-16740566.pdf?src-supplier=Future+Electronics; Supplier Part Number 1: 603-RC0402FR-07100RL; LCSC Part Number: C106232
TP1-TP5 = TEST POINT: Test Point ON; Item Type: TEST POINT
U1 = TPS54560BQDDARQ1: IC REG BCK SPLIT RAIL ADJ 8SOPWR; Manufacturer: Texas Instruments; Max Supply Voltage: 60V; Min Supply Voltage: 4.5V; Nominal Supply Current: 146uA; Supplier: Mouser; Supplier Part Number: 595-TPS54560BQDDARQ1; Manufacturer Part Number: TPS54560BQDDARQ1; RoHS: Yes; Item Type: IC; Stock: 1171; Pricing: 1=6.41, 10=5.44, 50=5.44, 100=4.7, 1000=3.4, 10000=3.29 (USD); Length: 4.89mm; Width: 3.9mm; Height: 1.7mm; Thickness: 1.48mm; ComponentLink1URL: http://www.ti.com/lit/ds/symlink/tps54560b-q1.pdf?src-supplier=Digikey; ComponentLink1Description: http://www.ti.com/lit/ds/symlink/tps54560b-q1.pdf?src-supplier=Digikey; LCSC Part Number: C2072188
U2 = MC7805BDTRKG: IC REG LINEAR 5V 1A DPAK; Manufacturer: onsemi; Item Type: Regulator; Manufacturer Part Number: MC7805BDTRKG; Package: TO-252-2(DPAK); LCSC Part Number: C110908; ComponentLink1Description: LCSC; ComponentLink1URL: https://www.lcsc.com/product-detail/Linear-Voltage-Regulators-LDO_onsemi-MC7805BDTRKG_C110908.html
U4 = LDL1117S33R: IC REG LINEAR 3.3V 1.2A SOT223; Manufacturer: STMicroelectronics; Output Type: Fixed; Output Configuration: Positive; Number of Regulators: 1; Max Input Voltage: 18V; Dropout Voltage: 600mV; Quiescent Current: 500uA; Power Supply Rejection Ratio (PSRR): 65dB; Supplier 1: Digi-Key; Manufacturer Part Number: LDL1117S33R; Stock 1: 13064; Pricing 1: 1=0.45, 10=0.362, 100=0.2465, 500=0.1849, 1000=0.13867 (USD); Mount: Surface Mount; Case/Package: TO-261-4; Min Operating Temperature: -40°C; Max Operating Temperature: 125°C; Packaging: Tape and Reel; Min Output Voltage: 3.3V; Output Current: 1.2A; Supplier Part Number 1: 497-17239-6-ND; ComponentLink1Description: LCSC; ComponentLink1URL: https://www.lcsc.com/product-detail/Linear-Voltage-Regulators-LDO_STMicroelectronics-LDL1117S33R_C435835.html; LCSC Part Number: C435835; Item Type: IC

## Nets that join several sheets
+3V3: Connector-Sheet (J3.4), Power-Sheet (6 pins)
+5V: Connector-Sheet (J3.3), Power-Sheet (6 pins)
+12V: Connector-Sheet (J3.1 J3.2), Power-Sheet (8 pins)
GND: Connector-Sheet (J3.5 J3.6), Power-Sheet (24 pins)